# EAGLE schematic schematic (EAGLE 9.6.0)
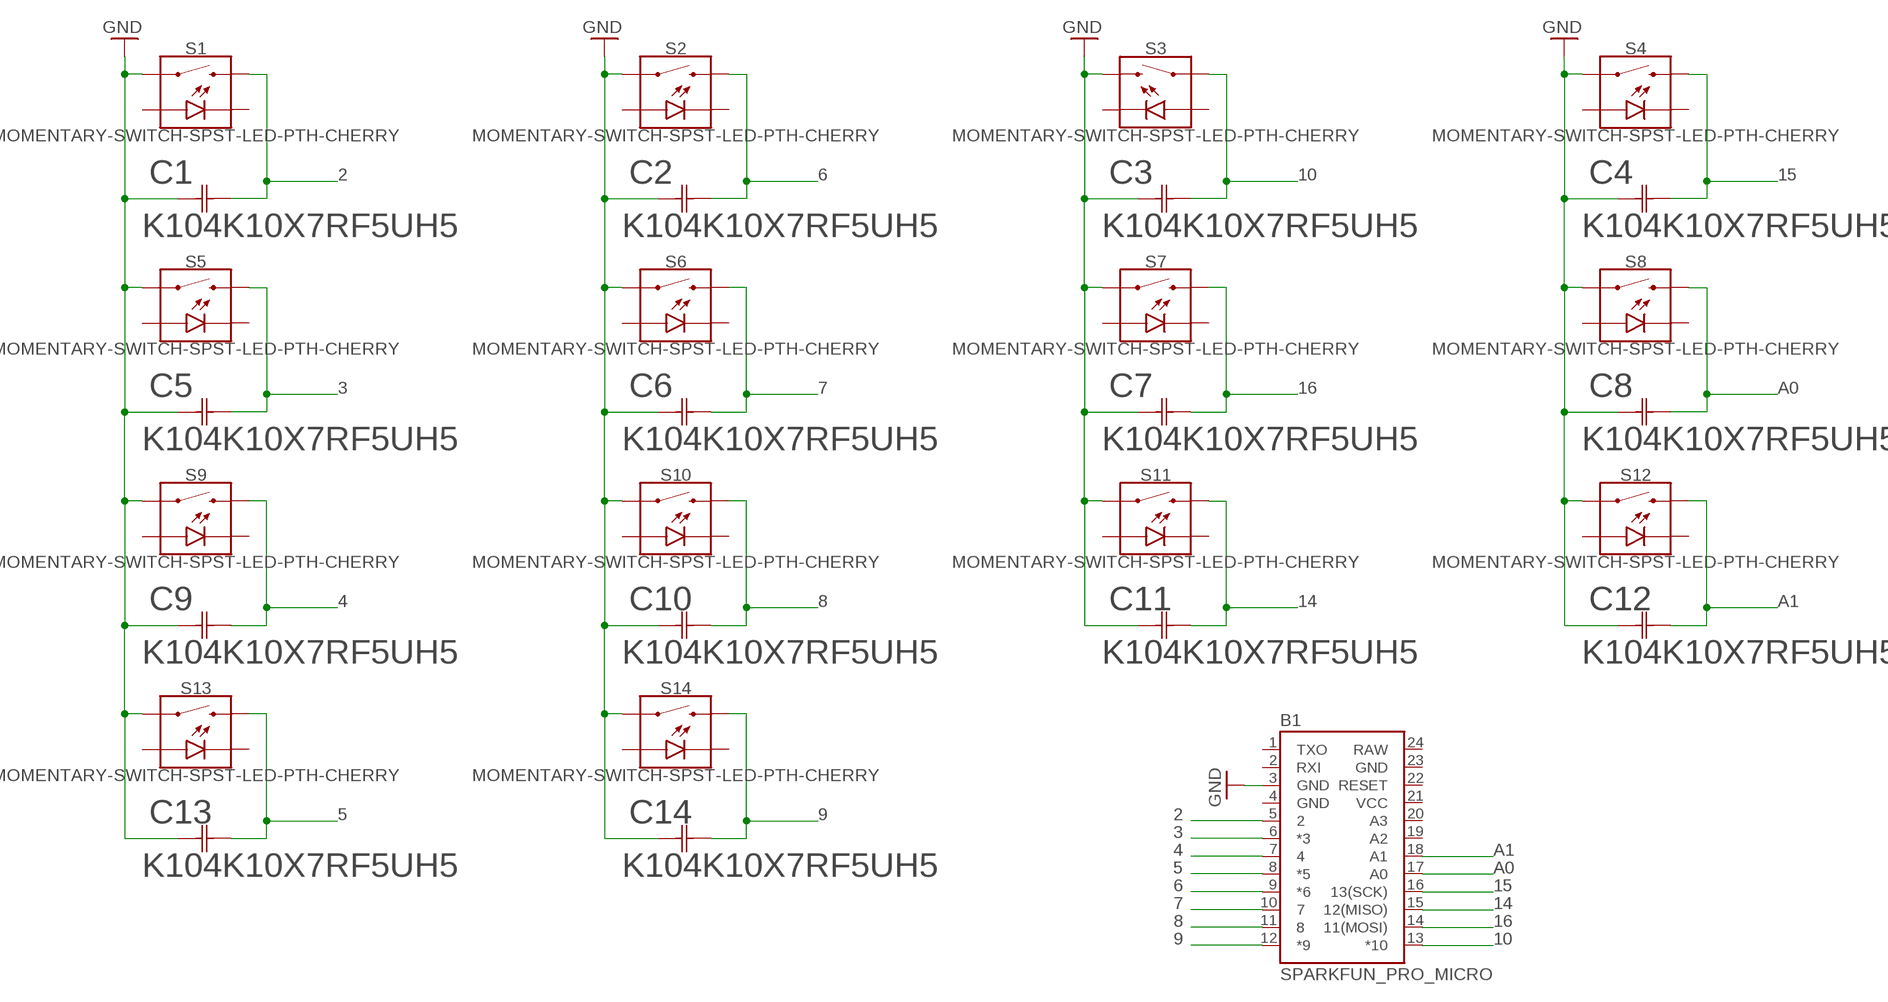
[diagram p0: schematic, sheet 1]

## Parts
B1  SPARKFUN_PRO_MICRO  [SPARKFUN_PRO_MICRO]
C1  K104K10X7RF5UH5  [K104K10X7RF5UH5_VIS]
C2  K104K10X7RF5UH5  [K104K10X7RF5UH5_VIS]
C3  K104K10X7RF5UH5  [K104K10X7RF5UH5_VIS]
C4  K104K10X7RF5UH5  [K104K10X7RF5UH5_VIS]
C5  K104K10X7RF5UH5  [K104K10X7RF5UH5_VIS]
C6  K104K10X7RF5UH5  [K104K10X7RF5UH5_VIS]
C7  K104K10X7RF5UH5  [K104K10X7RF5UH5_VIS]
C8  K104K10X7RF5UH5  [K104K10X7RF5UH5_VIS]
C9  K104K10X7RF5UH5  [K104K10X7RF5UH5_VIS]
C10  K104K10X7RF5UH5  [K104K10X7RF5UH5_VIS]
C11  K104K10X7RF5UH5  [K104K10X7RF5UH5_VIS]
C12  K104K10X7RF5UH5  [K104K10X7RF5UH5_VIS]
C13  K104K10X7RF5UH5  [K104K10X7RF5UH5_VIS]
C14  K104K10X7RF5UH5  [K104K10X7RF5UH5_VIS]
S1  MOMENTARY-SWITCH-SPST-LED-PTH-CHERRY  [CHERRY-MX-LED]
S2  MOMENTARY-SWITCH-SPST-LED-PTH-CHERRY  [CHERRY-MX-LED]
S3  MOMENTARY-SWITCH-SPST-LED-PTH-CHERRY  [CHERRY-MX-LED]
S4  MOMENTARY-SWITCH-SPST-LED-PTH-CHERRY  [CHERRY-MX-LED]
S5  MOMENTARY-SWITCH-SPST-LED-PTH-CHERRY  [CHERRY-MX-LED]
S6  MOMENTARY-SWITCH-SPST-LED-PTH-CHERRY  [CHERRY-MX-LED]
S7  MOMENTARY-SWITCH-SPST-LED-PTH-CHERRY  [CHERRY-MX-LED]
S8  MOMENTARY-SWITCH-SPST-LED-PTH-CHERRY  [CHERRY-MX-LED]
S9  MOMENTARY-SWITCH-SPST-LED-PTH-CHERRY  [CHERRY-MX-LED]
S10  MOMENTARY-SWITCH-SPST-LED-PTH-CHERRY  [CHERRY-MX-LED]
S11  MOMENTARY-SWITCH-SPST-LED-PTH-CHERRY  [CHERRY-MX-LED]
S12  MOMENTARY-SWITCH-SPST-LED-PTH-CHERRY  [CHERRY-MX-LED]
S13  MOMENTARY-SWITCH-SPST-LED-PTH-CHERRY  [CHERRY-MX-LED]
S14  MOMENTARY-SWITCH-SPST-LED-PTH-CHERRY  [CHERRY-MX-LED]

## Nets
2: B1.5 C1.2 S1.S2
3: B1.6(*3) C5.2 S5.S2
4: B1.7 C9.2 S9.S2
5: B1.8(*5) C13.2 S13.S2
6: B1.9(*6) C2.2 S2.S2
7: B1.10 C6.2 S6.S2
8: B1.11 C10.2 S10.S2
9: B1.12(*9) C14.2 S14.S2
10: B1.13(*10) C3.2 S3.S1
14: B1.15(12(MISO)) C11.2 S11.S2
15: B1.16(13(SCK)) C4.2 S4.S2
16: B1.14(11(MOSI)) C7.2 S7.S2
A0: B1.17(A0) C8.2 S8.S2
A1: B1.18(A1) C12.2 S12.S2
GND: B1.3(GND) C1.1 C2.1 C3.1 C4.1 C5.1 C6.1 C7.1 C8.1 C9.1 C10.1 C11.1 C12.1 C13.1 C14.1 S1.S1 S2.S1 S3.S2 S4.S1 S5.S1 S6.S1 S7.S1 S8.S1 S9.S1 S10.S1 S11.S1 S12.S1 S13.S1 S14.S1
Unconnected: B1.1(TXO) B1.2(RXI) B1.19(A2) B1.20(A3) B1.22(RESET) S1.A S1.K(C) S2.A S2.K(C) S3.A S3.K(C) S4.A S4.K(C) S5.A S5.K(C) S6.A S6.K(C) S7.A S7.K(C) S8.A S8.K(C) S9.A S9.K(C) S10.A S10.K(C) S11.A S11.K(C) S12.A S12.K(C) S13.A S13.K(C) S14.A S14.K(C)

## Power pins joined to a net without a drawn wire
GND: B1.4(GND) B1.23(GND)
RAW: B1.24(RAW)
VCC: B1.21(VCC)

## Library data of the parts
B1 = SparkFun-Boards:SPARKFUN_PRO_MICRO: SparkFun Pro Micro Atmega32U4 compatible footprint. SparkFun Products: 3.3V/8MHz <https://www.sparkfun.com/products/12587> 5V/16MHz <https://www.sparkfun.com/products/12640>
C1-C14 = E393:K104K10X7RF5UH5; COPYRIGHT: Copyright (C) 2024 Ultra Librarian. All rights reserved.; MANUFACTURER_PART_NUMBER: K104K10X7RF5UH5; MFR_NAME: Vishay; TYPE: Ceramic Capacitor
S1-S14 = SparkFun-Switches:MOMENTARY-SWITCH-SPST-LED: Momentary Switch (Pushbutton) - SPST - w/ LED Normally-open (NO) SPST momentary switches (buttons, pushbuttons), with a built-in LED. Variants PTH-CHERRY - Cherry MX Switch Cherry MX Keyswitches are top-of-the-line mechanical keyboard switches. They’re satisfyingly “clicky”, reliable up to tens-of-millions of key presses, and a standard in gaming and programming keyboards across the globe. This ‘blue’ version Cherry MX Switch is favored by most due to its secondary internal actuator making it less likely to “double-tap.” If you are looking for a noticeably audible and high-quality key switch, this is the perfect option for you! Cherry MX Switch <https://www.sparkfun.com/products/13834> (COM-13834) Cherry MX Switch Breakout <https://www.sparkfun.com/products/13773> (BOB-13773) PTH-12MM and PTH-12MM-KIT - 12mm Illuminated LED KIT variant is for soldering kits. There is no tStop (covering up the top side of the pads with mask). This helps the beginner see which side they should be soldering too. LED Tactile Button Breakout <https://www.sparkfun.com/products/10467> (BOB-10467) LED Tactile Button - Red <https://www.sparkfun.com/products/10442> (COM-10442) LED Tactile Button - Blue <https://www.sparkfun.com/products/10443> (COM-10443) LED Tactile Button - Green <https://www.sparkfun.com/products/10440> (COM-10440) LED Tactile Button - Orange <https://www.sparkfun.com/products/10441> (COM-10441) LED Tactile Button - White <https://www.sparkfun.com/products/10439> (COM-10439); SF_ID: COM-13834